# EAGLE design shrew-zero (EAGLE 7.6.0)
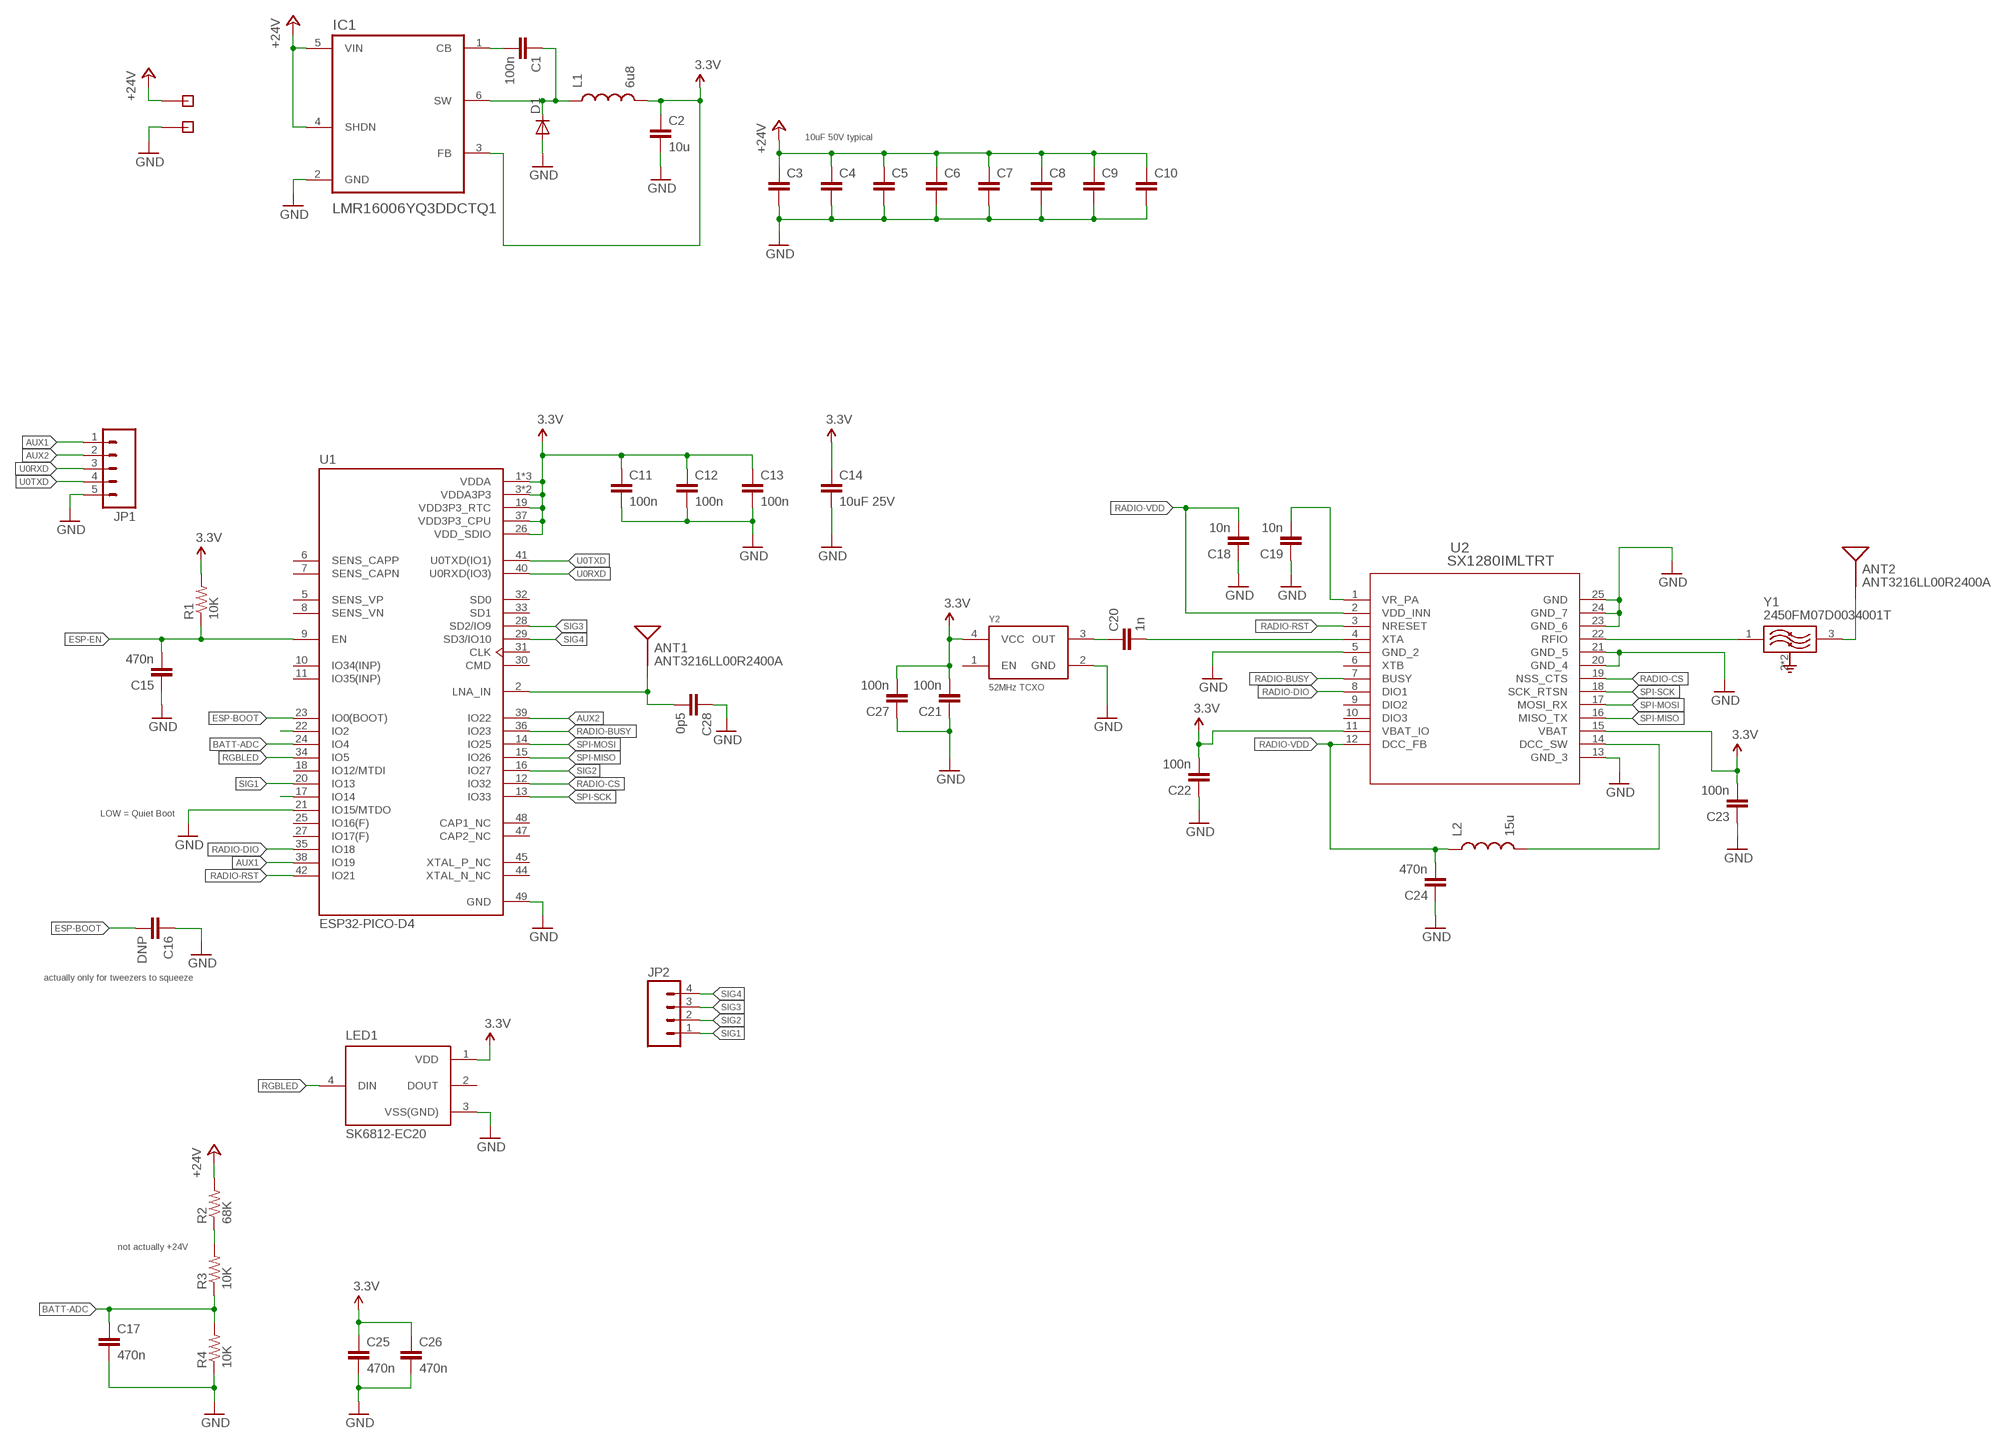
[diagram p0: schematic, sheet 1]

## Parts
ANT1  ANT3216LL00R2400A  ANTENNA2SMD  [ANTENNA-CHIP2]
ANT2  ANT3216LL00R2400A  ANTENNA2SMD  [ANTENNA-CHIP2]
C1  100n  CAP0402-REV  [0402-REV]
C2  10u  CAP0805  [0805]
C3  10u  CAP0805  [0805]
C4  10u  CAP0805  [0805]
C5  10u  CAP0805  [0805]
C6  10u  CAP0805  [0805]
C7  10u  CAP0805  [0805]
C8  10u  CAP0805  [0805]
C9  10u  CAP0805  [0805]
C10  10u  CAP0805  [0805]
C11  100n  CAP0402-REV  [0402-REV]
C12  100n  CAP0402-REV  [0402-REV]
C13  100n  CAP0402-REV  [0402-REV]
C14  10uF 25V  CAP0805  [0805]
C15  470n  CAP0402-REV  [0402-REV]
C16  DNP  CAP0402-CAP  [0402-CAP]
C17  470n  CAP0402-REV  [0402-REV]
C18  10n  CAP0402-REV  [0402-REV]
C19  10n  CAP0402-REV  [0402-REV]
C20  1n  CAP0402-REV  [0402-REV]
C21  100n  CAP0402-REV  [0402-REV]
C22  100n  CAP0402-REV  [0402-REV]
C23  100n  CAP0402-REV  [0402-REV]
C24  470n  CAP0402-REV  [0402-REV]
C25  470n  CAP0402-REV  [0402-REV]
C26  470n  CAP0402-REV  [0402-REV]
C27  100n  CAP0402-REV  [0402-REV]
C28  0p5  CAP0402-REV  [0402-REV]
D1  DIODESOD  [SOD-323]
IC1  LMR16006YQ3DDCTQ1  LMR16006XDDCR  [SOT95P280X110-6N]
JP1  M05PTH  [1X05]
JP2  M04-CLEAN  [1X04-CLEAN]
L1  6u8  INDUCTOR0805  [0805]
L2  15u  INDUCTOR0805  [0805]
LED1  SK6812-EC20  [SK6812-EC20]
R1  10K  RESISTOR0402-REV  [0402-REV]
R2  68K  RESISTOR0402-REV  [0402-REV]
R3  10K  RESISTOR0402-REV  [0402-REV]
R4  10K  RESISTOR0402-REV  [0402-REV]
U1  ESP32-PICO-D4  [PQFN50P700X700X104-49N]
U2  SX1280IMLTRT  [QFN24_4X4_SEM]
X1  PIN-1X-BIG  [PAD-1X-BIG]
X2  PIN-1X-BIG  [PAD-1X-BIG]
Y1  2450FM07D0034001T  2450FM07D0034T  [FIL_2450FM07D0034T]
Y2  52MHz TCXO  OSCILLATOR-TG2016SMN  [OSC_TG2016SMN_50.0000M-ECGNNMB]

## Nets
3.3V: C2.1 C11.1 C12.1 C13.1 C14.1 C21.2 C22.2 C23.2 C25.1 C26.1 C27.2 IC1.3(FB) L1.2 LED1.1(VDD) R1.2 U1.1(VDDA) U1.3(VDDA3P3) U1.4(VDDA3P3) U1.19(VDD3P3_RTC) U1.26(VDD_SDIO) U1.37(VDD3P3_CPU) U1.43(VDDA) U1.46(VDDA) U2.11(VBAT_IO) U2.15(VBAT) Y2.4(VCC)
+24V: C3.1 C4.1 C5.1 C6.1 C7.1 C8.1 C9.1 C10.1 IC1.4(SHDN) IC1.5(VIN) R2.2 X1.1
AUX1: JP1.1 U1.38(IO19)
AUX2: JP1.2 U1.39(IO22)
BATT-ADC: C17.1 R3.1 R4.2 U1.24(IO4)
ESP-BOOT: C16.2 U1.23(IO0(BOOT))
ESP-EN: C15.2 R1.1 U1.9(EN)
GND: C2.2 C3.2 C4.2 C5.2 C6.2 C7.2 C8.2 C9.2 C10.2 C11.2 C12.2 C13.2 C14.2 C15.1 C16.1 C17.2 C18.1 C19.1 C21.1 C22.1 C23.1 C24.1 C25.2 C26.2 C27.1 C28.1 D1.2(A) IC1.2(GND) JP1.5 LED1.3(VSS(GND)) R4.1 U1.21(IO15/MTDO) U1.49(GND) U2.5(GND_2) U2.13(GND_3) U2.20(GND_4) U2.21(GND_5) U2.23(GND_6) U2.24(GND_7) U2.25(GND) X2.1 Y2.2(GND)
N$1: ANT1.FEED(SIGNAL) C28.2 U1.2(LNA_IN)
N$2: C20.1 Y2.3(OUT)
N$3: C20.2 U2.4(XTA)
N$4: C1.2 IC1.1(CB)
N$5: U1.17(IO14)
N$6: U2.22(RFIO) Y1.1(IN)
N$7: ANT2.FEED(SIGNAL) Y1.3(OUT)
N$8: U1.22(IO2)
N$9: L2.2 U2.14(DCC_SW)
N$10: C1.1 D1.1(C) IC1.6(SW) L1.1
N$11: C19.2 U2.1(VR_PA)
RADIO-BUSY: U1.36(IO23) U2.7(BUSY)
RADIO-CS: U1.12(IO32) U2.19(NSS_CTS)
RADIO-DIO: U1.35(IO18) U2.8(DIO1)
RADIO-RST: U1.42(IO21) U2.3(NRESET)
RADIO-VDD: C18.2 C24.2 L2.1 U2.2(VDD_INN) U2.12(DCC_FB)
RGBLED: LED1.4(DIN) U1.34(IO5)
SIG1: JP2.1 U1.20(IO13)
SIG2: JP2.2 U1.16(IO27)
SIG3: JP2.3 U1.28(SD2/IO9)
SIG4: JP2.4 U1.29(SD3/IO10)
SPI-MISO: U1.15(IO26) U2.16(MISO_TX)
SPI-MOSI: U1.14(IO25) U2.17(MOSI_RX)
SPI-SCK: U1.13(IO33) U2.18(SCK_RTSN)
U0RXD: JP1.3 U1.40(U0RXD(IO3))
U0TXD: JP1.4 U1.41(U0TXD(IO1))
V-ADC: R2.1 R3.2
Unconnected: LED1.2(DOUT) U1.5(SENS_VP) U1.6(SENS_CAPP) U1.7(SENS_CAPN) U1.8(SENS_VN) U1.10(IO34(INP)) U1.11(IO35(INP)) U1.18(IO12/MTDI) U1.25(IO16(F)) U1.27(IO17(F)) U1.30(CMD) U1.31(CLK) U1.32(SD0) U1.33(SD1) U1.44(XTAL_N_NC) U1.45(XTAL_P_NC) U1.47(CAP2_NC) U1.48(CAP1_NC) U2.6(XTB) U2.9(DIO2) U2.10(DIO3) Y2.1(EN)

## Notes on the sheet
- 10uF 50V typical
- LOW = Quiet Boot
- actually only for tweezers to squeeze
- not actually +24V

## Power pins joined to a net without a drawn wire
GND: Y1.2(GND) Y1.4(GND)

## Library data of the parts
ANT1 ANT2 = shrew-common:ANTENNA2: Antenna Single endded antenna. Common with smaller chip antennas. CHIP4 package is the GPS Chip Antenna SKU: GPS-08418. CHIP5 package is 2.4GHz chip antenna SKU: WRL-00144.
C1-C28 = shrew-common:CAP: Capacitor Standard 0603 ceramic capacitor, and 0.1" leaded capacitor.
D1 = shrew-common:DIODE: Diode These are standard reverse protection diodes and small signal diodes. SMA package can handle up to about 1A. SOD-323 can handle about 200mA. What the SOD-323 package when ordering, there are some mfgs out there that are 5-pin packages.
IC1 = shrew-core:LMR16006XDDCR: Check availability <https://pricing.snapeda.com/parts/LMR16006XDDCR/Texas%20Instruments/view-part?ref=eda>; AVAILABILITY: In Stock; CHECK_PRICES: https://www.snapeda.com/parts/LMR16006XDDCR/Texas+Instruments/view-part/?ref=eda; DESCRIPTION: SIMPLE SWITCHER&reg; 4V to 60V, 600mA Step-Down Regulator with Low Iq; MF: Texas Instruments; MP: LMR16006XDDCR; PACKAGE: SOT-23-THN-6 Texas Instruments; PRICE: None; SNAPEDA_LINK: https://www.snapeda.com/parts/LMR16006XDDCR/Texas+Instruments/view-part/?ref=snap
JP1 = shrew-common:M05: Header 5 Standard 5-pin 0.1" header. Use with straight break away headers (SKU : PRT-00116), right angle break away headers (PRT-00553), swiss pins (PRT-00743), machine pins (PRT-00117), and female headers (PRT-00115). Molex polarized connector foot print use with SKU : PRT-08230 with associated crimp pins and housings.
JP2 = shrew-common:M04: Header 4 Standard 4-pin 0.1" header. Use with straight break away headers (SKU : PRT-00116), right angle break away headers (PRT-00553), swiss pins (PRT-00743), machine pins (PRT-00117), and female headers (PRT-00115). Molex polarized connector foot print use with SKU : PRT-08231 with associated crimp pins and housings. 1MM SMD Version SKU: PRT-10208
L1 L2 = shrew-common:INDUCTOR: Inductors Basic Inductor/Choke - 0603 and 1206. Footprints are not proven and vary greatly between part numbers.
LED1 = shrew-core:SK6812: SMD 5050 Full color RGB LED data transmission frequency up to 800Kbps, with 30 fps refresh rate, 5.00x5.00 mm Check availability <https://pricing.snapeda.com/parts/SK6812/Shenzhen%20LED%20Color%20Optoelectronic%20Inc./view-part?ref=eda>
R1-R4 = shrew-common:RESISTOR: Resistor Basic schematic elements and footprints for 0603, 1206, and PTH resistors.
U1 = shrew-core:ESP32-PICO-D4: Bluetooth, WiFi 802.11b/g/n, Bluetooth v4.2 +EDR, Class 1, 2 and 3 Transceiver Module 2.4GHz ~ 2.5GHz Surface Mount Check availability <https://pricing.snapeda.com/parts/ESP32-PICO-D4/Espressif%20Systems/view-part?ref=eda>; AVAILABILITY: In Stock; CHECK_PRICES: https://www.snapeda.com/parts/ESP32-PICO-D4/Espressif+Systems/view-part/?ref=eda; DESCRIPTION: Bluetooth, WiFi 802.11b/g/n, Bluetooth v4.2 +EDR, Class 1, 2 and 3 Transceiver Module 2.4GHz ~ 2.5GHz - Surface Mount; MF: Espressif Systems; MP: ESP32-PICO-D4; PACKAGE: SMD-48 Espressif Systems; PRICE: None; SNAPEDA_LINK: https://www.snapeda.com/parts/ESP32-PICO-D4/Espressif+Systems/view-part/?ref=snap
U2 = shrew-core:SX1280IMLTRT; COPYRIGHT: Copyright (C) 2024 Ultra Librarian. All rights reserved.; MANUFACTURER_PART_NUMBER: SX1280IMLTRT; MFR_NAME: Semtech
X1 X2 = shrew-core:PIN-1X
Y1 = shrew-core:2450FM07D0034T: 2.4GHz ~ 2.5GHz Frequency RF Filter (Radio Frequency) 100MHz Bandwidth 0.75dB 0402 (1005 Metric), 4 PC Pad Check availability <https://pricing.snapeda.com/parts/2450FM07D0034T/Johanson%20Technology%20Inc./view-part?ref=eda>; AVAILABILITY: In Stock; CHECK_PRICES: https://www.snapeda.com/parts/2450FM07D0034T/Johanson+Technology+Inc./view-part/?ref=eda; DESCRIPTION: 2.4GHz ~ 2.5GHz Frequency - RF Filter (Radio Frequency) 100MHz Bandwidth 0.75dB 0402 (1005 Metric), 4 PC Pad; MF: Johanson Technology Inc.; MP: 2450FM07D0034T; PACKAGE: 0402 Johanson Technology Inc.; PRICE: None; SNAPEDA_LINK: https://www.snapeda.com/parts/2450FM07D0034T/Johanson+Technology+Inc./view-part/?ref=snap
Y2 = shrew-common:OSCILLATOR

## Board
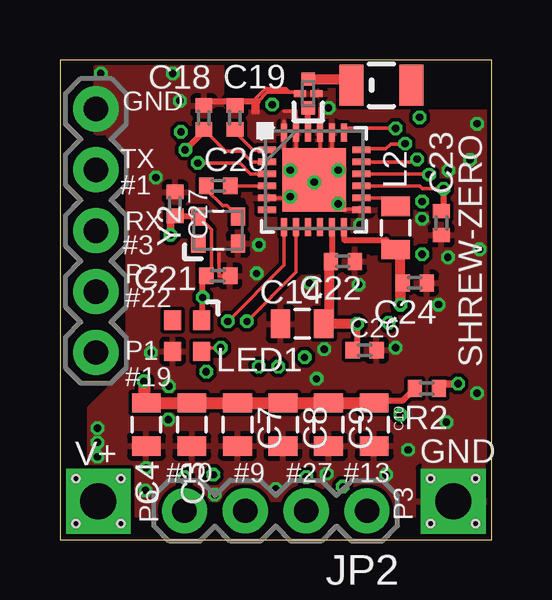
[diagram p1: board, top side]
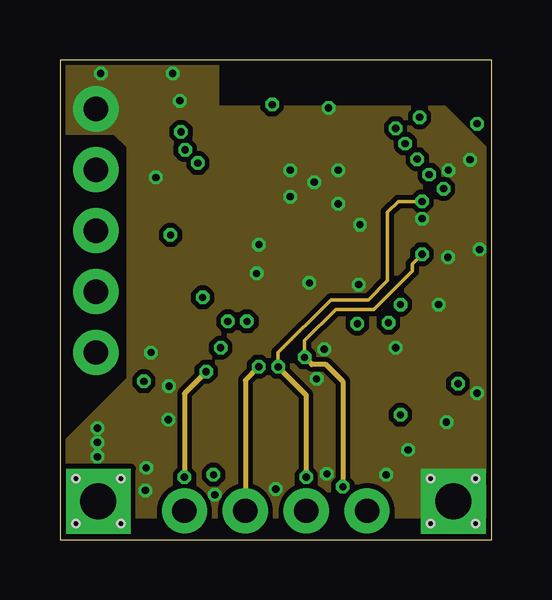
[diagram p2: board, inner layer Route2]
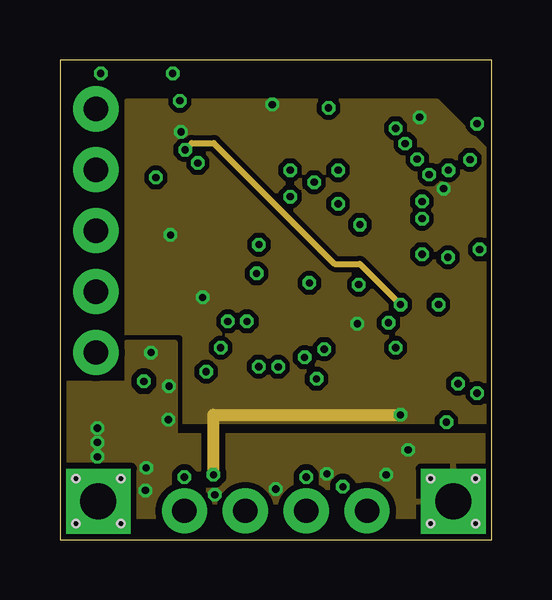
[diagram p3: board, inner layer Route15]
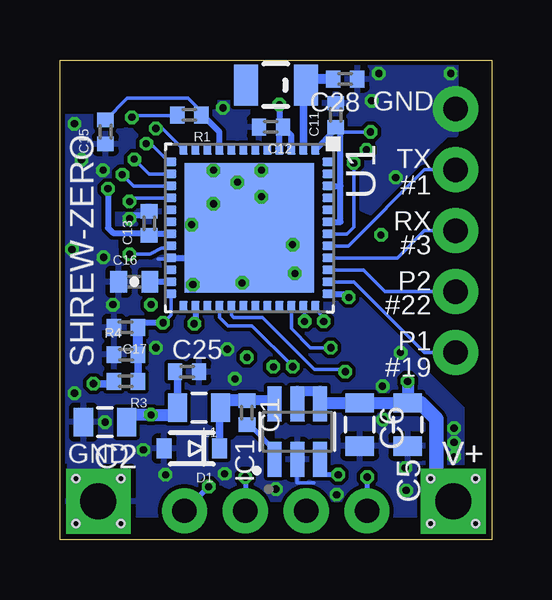
[diagram p4: board, bottom side, seen from below]

Size 18 x 20 mm. Coordinates in mm from the lower left corner, seen from the top.
Outline: 18,20 0,20 0,0 18,0 18,20
Copper layers (1+2*15+16): Top 0.035mm / dielectric 0.2mm / Route2 0.0175mm / dielectric 1.065mm / Route15 0.0175mm / dielectric 0.2mm / Bottom 0.035mm
Design rules "jlcpcb-4layers": minimum track width 3.5mil, minimum drill 0.2mm, track to track 5mil, track to pad 5mil, pad to pad 5mil, via to via 5mil, smd to smd 5mil, copper to edge 0.2mm, drill to drill 6mil, minimum pad ring 10mil, minimum via ring 0.13mm, stop-mask expansion 0.05mm, vias tented up to drill 16mil, thermal gap 8mil
tRestrict: area 12.4,18.1 to 14.2,19.8; area 7,18.1 to 9.9,20; area 14.2,18.1 to 18,19.8; 13 lines
bRestrict: area 11.6,18.1 to 15.2,19.8; area 15.2,17.9 to 18,19.8; 17 lines
vRestrict: area 11.6,18.1 to 15.2,19.8; area 7,18.4 to 10.8,20; area 15.2,18.1 to 16.6,19.8

### Footprints (pad centres in the part's own frame; a part is rotated, then mirrored left to right if it is on the bottom)
ANTENNA-CHIP2 = smd 1.7 x 1: ? 0,-1.25; FEED 0,1.25
0402-REV = smd 0.6 x 0.7: 1 -0.5,0; 2 0.5,0
0805 = smd 0.8 x 1.2: 1 -0.9,0; 2 0.9,0
0402-CAP = smd 0.7 x 0.9: 1 -0.65,0; 2 0.65,0
SOD-323 = smd 0.63 x 0.83: 1 -1.15,0; 2 1.15,0
SOT95P280X110-6N = smd 1.45 x 0.59: 1 -1.155,0.95; 2 -1.155,0; 3 -1.155,-0.95; 4 1.155,-0.95; 5 1.155,0; 6 1.155,0.95
1X05 = drill 1.016 pad 1.88: 1 0,0; 2 2.54,0; 3 5.08,0; 4 7.62,0; 5 10.16,0
1X04-CLEAN = drill 1.016 pad 1.88: 1 0,0; 2 2.54,0; 3 5.08,0; 4 7.62,0
SK6812-EC20 = smd 0.8 x 0.7: 1 0.65,-0.6; 2 0.65,0.6; 3 -0.65,0.6; 4 -0.65,-0.6
PQFN50P700X700X104-49N = smd 0.45 x 0.35: 1 -3.265,2.75; 2 -3.265,2.25; 3 -3.265,1.75; 4 -3.265,1.25; 5 -3.265,0.75; 6 -3.265,0.25; 7 -3.265,-0.25; 8 -3.265,-0.75; 9 -3.265,-1.25; 10 -3.265,-1.75; 11 -3.265,-2.25; 12 -3.265,-2.75; 25 3.265,-2.75; 26 3.265,-2.25; 27 3.265,-1.75; 28 3.265,-1.25; 29 3.265,-0.75; 30 3.265,-0.25; 31 3.265,0.25; 32 3.265,0.75; 33 3.265,1.25; 34 3.265,1.75; 35 3.265,2.25; 36 3.265,2.75 | smd 0.35 x 0.45: 13 -2.75,-3.265; 14 -2.25,-3.265; 15 -1.75,-3.265; 16 -1.25,-3.265; 17 -0.75,-3.265; 18 -0.25,-3.265; 19 0.25,-3.265; 20 0.75,-3.265; 21 1.25,-3.265; 22 1.75,-3.265; 23 2.25,-3.265; 24 2.75,-3.265; 37 2.75,3.265; 38 2.25,3.265; 39 1.75,3.265; 40 1.25,3.265; 41 0.75,3.265; 42 0.25,3.265; 43 -0.25,3.265; 44 -0.75,3.265; 45 -1.25,3.265; 46 -1.75,3.265; 47 -2.25,3.265; 48 -2.75,3.265 | smd 5.4 x 5.4: 49 0,0
QFN24_4X4_SEM = smd 0.762 x 0.254: 1 -1.968,1.25; 2 -1.968,0.75; 3 -1.968,0.25; 4 -1.968,-0.25; 5 -1.968,-0.75; 6 -1.968,-1.25; 13 1.968,-1.25; 14 1.968,-0.75; 15 1.968,-0.25; 16 1.968,0.25; 17 1.968,0.75; 18 1.968,1.25 | smd 0.254 x 0.762: 7 -1.25,-1.968; 8 -0.75,-1.968; 9 -0.25,-1.968; 10 0.25,-1.968; 11 0.75,-1.968; 12 1.25,-1.968; 19 1.25,1.968; 20 0.75,1.968; 21 0.25,1.968; 22 -0.25,1.968; 23 -0.75,1.968; 24 -1.25,1.968 | smd 2.642 x 2.642: 25 0,0
PAD-1X-BIG = drill 1.5 pad 2.5 square: 1 0,0 | hole 0.3: -0.94,0.94; 0.94,0.94; -0.94,-0.94; 0.94,-0.94
FIL_2450FM07D0034T = smd 0.55 x 0.55: 1 -0.6,0; 3 0.6,0 | smd 0.3 x 0.5: 2 0,-0.35; 4 0,0.35
OSC_TG2016SMN_50.0000M-ECGNNMB = smd 0.75 x 0.6: 1 -0.565,0.825; 2 -0.565,-0.825; 3 0.565,-0.825; 4 0.565,0.825

### Placement (x,y rotation side)
ANT1  9,18.95 270 bottom
ANT2  13.4,18.95 90 top
C1  10.2,5.3 270 bottom
C2  16.12,4.9 180 bottom
C3  5.5,4.8 270 top
C4  3.6,4.8 270 top
C5  3.5,4.8 270 bottom
C6  5.5,4.8 270 bottom
C7  7.4,4.8 270 top
C8  9.3,4.8 270 top
C9  11.2,4.8 270 top
C10  13.1,4.8 270 top
C11  6.5,17.7 90 bottom
C12  9.2,17.2 180 bottom
C13  14.28,13.18 90 bottom
C14  10.1,9 180 top
C15  16.1,17 90 bottom
C16  14.9,10.75 0 bottom
C17  15.25,8.85 180 bottom
C18  6,17.6 270 top
C19  7.3,17.6 270 top
C20  6.6,14.75 0 top
C21  6.6,11 180 top
C22  11.8,11.6 180 top
C23  15.9,13.2 90 top
C24  14.8,10.7 180 top
C25  12.7,7 0 bottom
C26  12.7,7.9 0 top
C27  4.8,14 270 top
C28  6.1,19.2 180 bottom
D1  12.5,3.8 180 bottom
IC1  8.1,4.5 90 bottom
JP1  1.5,7.8 90 top
JP2  12.81,1.2 180 top
L1  12.2,5.5 180 bottom
L2  14,13 90 top
LED1  5.3,8.5 90 top
R1  12.6,17.7 180 bottom
R2  15.3,6.3 180 top
R3  15.25,6.6 180 bottom
R4  15.25,7.71 0 bottom
U1  10.1,13 270 bottom
U2  10.6,15 0 top
X1  1.6,1.6 0 top
X2  16.4,1.6 0 top
Y1  10.35,18.6 90 top
Y2  6.6,12.9 90 top

### Tracks (layer width: path | path; a pad name or v marks a point on that pad's centre or on a via)
3.3V  (via drill 0.3)
  Top 0.152: Y2.4 6.32,12.92 6.32,11 C21.2 | U2.15 15,14.75 15.12,14.63 v16,14.63
  Top 0.254: U2.11 11.35,11.9 C22.2 | 5.78,13.5 Y2.4 5.74,13.5 C27.2 4.61,13.5 | LED1.1 5.95,9.2 v5.95,10.1 5.95,11 C21.2 | C23.2 16,13.7 v16,14.63 | v12.4,9 12.4,8.1 12.2,8.1 C26.1
  Top 0.305: v4.61,12.7 4.61,13.5
  Top 0.406: v12.4,9 11.15,9 11.15,9.15 C14.1 11.21,9 11.21,11.51 C22.2
  Route15 0.5: v6.4,2.7 6.4,5.2 v14.2,5.2
  Bottom 0.152: v5.05,17 6.3,17 6.36,17 | v15,17.61 14.94,17.67 13.1,17.67 R1.2
  Bottom 0.203: v6.4,2.7 7.15,2.7 IC1.3
  Bottom 0.254: U1.3 8.35,16.85 C12.1 | U1.4 8.85,16.9 C12.1 | v8.85,18.14 8.85,17.5 C12.1 | U1.1 6.57,17.05 C11.1 6.3,17.05 6.3,17 6.3,14.75 | U1.46 6.3,14.75 | U1.43 6.3,13.25 6.3,14.75 | U1.37 5.95,10.25 v5.95,10.1 | v16,14.63 16,13 15.79,12.79 14.28,12.79 C13.1 14.28,12.75 U1.19 | U1.26 12.35,9.05 v12.4,9
  Bottom 0.305: 13.1,5.7 13.1,6.8 C25.1
  Bottom 0.5: 13.1,5.7 L1.2 13.1,5.2 v14.2,5.2 15.22,5.2 C2.1
  pour Route15 (isolate 0.203, rank 5, no thermals): 2.8,4.9 2.8,18.3 15.7,18.3 18,16 18,4.9
+24V  (via drill 0.3)
  Top 0.254: C10.1 13.5,5.7 13.5,5.8 14.3,5.8 R2.2
  Top 0.5: C10.1 C9.1 C8.1 C7.1 C6.1 C4.1 C5.1 v3.5,6.6
  Bottom 0.406: IC1.5 8.1,6.2 7.15,6.2 7.15,5.7 IC1.4
  Bottom 0.5: 7.15,5.7 C6.1 C5.1 v3.5,6.6
  Bottom 0.6: X1.1 2.3,2.3 2.3,5.03 2.97,5.7 C5.1
AUX1
  Bottom 0.152: U1.38 5.75,10.75 2.8,7.8 JP1.1
AUX2
  Bottom 0.152: U1.39 5.35,11.25 4.44,10.34 JP1.2
BATT-ADC  (via drill 0.3)
  Bottom 0.152: v13.7,9.04 13.37,9.38 U1.24
  Bottom 0.254: v13.7,9.04 14.75,9.04 C17.1
  Bottom 0.305: R3.1 R4.2
  Bottom 0.406: R4.2 C17.1
ESP-BOOT
  Bottom 0.152: C16.2 14.2,10.75
  Bottom 0.254: U1.23 14.2,10.75
ESP-EN
  Bottom 0.152: C15.2 15.2,18.4 12.66,18.4 12.1,17.84 R1.1
  Bottom 0.254: U1.9 11.35,17 12.05,17.7 R1.1
GND  (via drill 0.3)
  Top 0.152: v11.2,18 10.85,18 U2.21 | 6.63,11.93 6.63,11 6.99,11 | U2.5 10.6,14.25 U2.25 | 12.44,13.78 10.6,13.78 U2.25 | 11.35,16.79 11.35,15 U2.25 | U2.21 10.85,15 U2.25 | U2.25 9.85,15 U2.23 9.85,17.87 9.35,17.87 | 9.35,17.45 9.35,15 U2.25 | 10.04,18.66 9.57,18.66 | 9.57,18.66 8.64,18.66 8.25,18.27 8.25,17.8 | U2.21 10.85,15.4 v11.6,15.4 | 8.15,18.27 8.15,17.8 | 8.05,18.27 8.05,17.8 | 9.57,18.66 9.42,18.81 8.58,18.81 8.06,18.29
  Top 0.254: 8.25,18.27 8.15,18.27 8.05,18.27 7.3,18.27 | 7.3,18.27 6.07,18.27 | C19.1 7.3,18.27
  Bottom 0.152: U1.49 10.6,13.5 v10.6,14.9 | 12.5,11.7 13.9,11.7 | 7.4,2.37 8.11,2.37 8.11,2.78
  Bottom 0.254: U1.21 12.46,11.75 v12.46,10.63 | C13.2 14.45,13.51 15.1,13.51 v15.1,13.38
  Bottom 0.5: X2.1 16.1,1.9
  other vias: 12.51,13.13 16.18,11.77 9.6,15.4 9.6,14.3 11.6,14 8.3,12.3 8.2,11.1 5,18.3 16.2,15.4 15.79,9.8 10.4,10.7 4,15.1 3.8,7.8 17.4,6.1 9,2.1 6.46,1.87 3.6,2.99 13.6,2.7 3.56,2.05 1.56,3.45 1.56,4.05 1.56,4.65 17.1,15.84 17.5,12.1 4.55,6.4 4.52,5 10.7,6.7 11.02,7.94 11.13,2.74 14,8 14.52,3.74 16.12,4.9 17.4,17.34 1.7,19.44 4.7,19.44
  pour Top (isolate 0.152, rank 5): 1.2,1 1.2,5.5 2.8,7.1 2.8,16 1.5,17.3 1.5,20 18,20 18,1
  pour Bottom (isolate 0.152, rank 5): 1.2,1 1.2,5.5 2.8,7.1 2.8,15.9 1.5,17.2 1.5,20 18,20 18,1
  pour Route2 (isolate 0.203, no thermals): 0,1 0,3.8 2.9,6.7 2.9,16.4 2.3,17 0,17 0,20 6.5,20 6.5,18 16,18 18,16 18,1
  pour Top (isolate 0.254, rank 4, no thermals): 1.5,20 1.5,17 4.1,17 4.1,20
  pour Bottom (isolate 0.152, no thermals): 1.5,20 4.1,20 4.1,16.9 1.5,16.9
  pour Bottom (isolate 0.254, no thermals): 15.2,2.8 16.4,2.8 16.4,3.4 17.6,3.4 17.6,-0.1 15.2,-0.1
  pour Top (isolate 0.254, no thermals): 17.7,3.4 15.2,3.4 15.2,2.7 17.7,2.7
  pour Route15 (isolate 0.254): 0,1 18,1 18,4.3 4.8,4.3 4.8,8.2 2.8,8.2 2.8,6.5 0,6.5
N$1
  Bottom 0.305: U1.2 7.85,18.95 ANT1.FEED
  Bottom 0.406: C28.2 7.5,19.2 ANT1.FEED
N$2
  Top 0.152: Y2.3 6.97,13.92 6.78,13.92 6.1,14.6 C20.1
N$3
  Top 0.152: C20.2 U2.4
N$4
  Bottom 0.203: IC1.1 9.05,3.75 10,4.7 C1.2
N$6
  Top 0.25: U2.22 Y1.1
N$7
  Top 0.406: Y1.3 12.15,19.2 ANT2.FEED
N$9
  Top 0.152: U2.14 13.6,14.25 L2.2
N$10
  Bottom 0.305: D1.1 11.35,5.75 L1.1
  Bottom 0.406: IC1.6 9.05,5.8 C1.1
  Bottom 0.5: C1.1 11.3,5.8 L1.1
N$11
  Top 0.152: U2.1 8.05,16.25 7.35,16.95 C19.2
RADIO-BUSY  (via drill 0.3)
  Top 0.152: U2.7 9.35,11.45 v7,9.1
  Bottom 0.152: v7,9.1 7.12,9.22 7.03,9.29 7.35,9.61 U1.36
RADIO-CS  (via drill 0.3)
  Top 0.152: v14,17.15 11.85,17.15 U2.19
  Bottom 0.152: U1.12 13.73,17.15 v14,17.15
RADIO-DIO  (via drill 0.3)
  Top 0.152: U2.8 9.85,11.15 v7.8,9.1
  Bottom 0.152: U1.35 7.8,9.73 v7.8,9.1
RADIO-RST  (via drill 0.3)
  Top 0.152: U2.3 7.95,15.25 7.5,15.7 v5.75,15.7
  Bottom 0.152: U1.42 6.04,12.75 5.75,13.04 v5.75,15.7
RADIO-VDD  (via drill 0.3)
  Top 0.152: U2.2 8.01,15.75 7.56,16.2 6.9,16.2 C18.2 6,16.97 5.94,16.97
  Top 0.254: 13.8,12.1 L2.1 13.6,12.5 11.85,12.5 U2.12 | v5.22,16.25 5.94,16.97
  Top 0.406: L2.1 14.2,12.1 v14.2,9.8 14.2,10.7 C24.2
  Route15 0.254: v5.22,16.25 5.5,16.53 6.42,16.53 11.45,11.5 12.5,11.5 v14.2,9.8
RGBLED  (via drill 0.3)
  Top 0.152: LED1.4 6.05,8 v6.7,8
  Bottom 0.152: v6.7,8 7.55,8 8.35,8.8 U1.34
SIG1  (via drill 0.3)
  Route2 0.152: v10.2,7.6 10.2,8.3 11.5,9.6 13.1,9.6 14.7,11.2 14.7,11.5 v15.1,11.9
  Route2 0.203: v11.8,2.2 11.8,6.6 11.1,7.3 10.5,7.3 v10.2,7.6
  Bottom 0.152: v15.1,11.9 14.23,11.9 13.76,12.16 13.37,12.16 U1.20
  Bottom 0.203: v11.8,2.2 JP2.1
SIG2  (via drill 0.3)
  Route2 0.152: v9.1,7.2 9.1,7.8 11.3,10 12.86,10 13.66,10.8 13.66,13.65 14.11,14.1 v15.1,14.1
  Route2 0.203: v9.1,7.2 10.27,6.03 v10.27,2.6
  Bottom 0.152: U1.16 14.95,14.25 v15.1,14.1
  Bottom 0.203: v10.27,2.6 JP2.2
SIG3  (via drill 0.3)
  Route2 0.203: v8.29,7.21 7.73,6.65 JP2.3
  Bottom 0.152: U1.28 11.35,9.27 10.98,8.9 9.98,8.9 v8.29,7.21
SIG4  (via drill 0.3)
  Route2 0.203: v6.1,7 5.19,6.09 v5.19,2.6
  Bottom 0.152: U1.29 10.85,9.36 10.76,9.27 9.55,9.27 7.38,7.1 6.2,7.1 v6.1,7
  Bottom 0.203: v5.19,2.6 JP2.4
SPI-MISO  (via drill 0.3)
  Top 0.152: U2.16 15.37,15.25 v15.4,15.22
  Bottom 0.152: U1.15 14.93,14.75 v15.4,15.22
SPI-MOSI  (via drill 0.3)
  Top 0.152: U2.17 14.79,15.75 v14.9,15.86
  Bottom 0.152: U1.14 14.29,15.25 v14.9,15.86
SPI-SCK  (via drill 0.3)
  Top 0.152: U2.18 12.85,16.25 12.9,16.3 13.59,16.3 13.8,16.5 v14.39,16.5 arc90 v14.4,16.51
  Bottom 0.152: U1.13 13.45,15.75 14.21,16.51 v14.4,16.51
U0RXD
  Bottom 0.152: U1.40 3.93,11.75 2.8,12.88 JP1.3
U0TXD
  Bottom 0.152: U1.41 5.97,12.25 2.8,15.42 JP1.4
V-ADC  (via drill 0.3)
  Top 0.305: R2.1 15.8,6.5 v16.6,6.5
  Bottom 0.305: R3.2 15.85,6.5 v16.6,6.5

### Text on the board
tPlace: GND | TX | #1 | RX | #3 | P2 | #22 | P1 | #19 | SHREW-ZERO | V+ | GND | #10 | #9 | #27 | #13 | P3 | P6
bPlace: GND | TX | #1 | RX | #3 | P2 | #22 | P1 | #19 | SHREW-ZERO | V+ | GND